# EasyEDA Pro project 组6-最终系统PCB.eprj

# Schematic Schematic1
Board Name: Board1; Create Date: 2024-12-04; Page Name: P1; Project Name: STC15娱乐掌机V3; Schematic Name: Schematic1; Update Date: 2024-12-04; Company: 嘉立创EDA; Page Size: A4; Version: V1.0
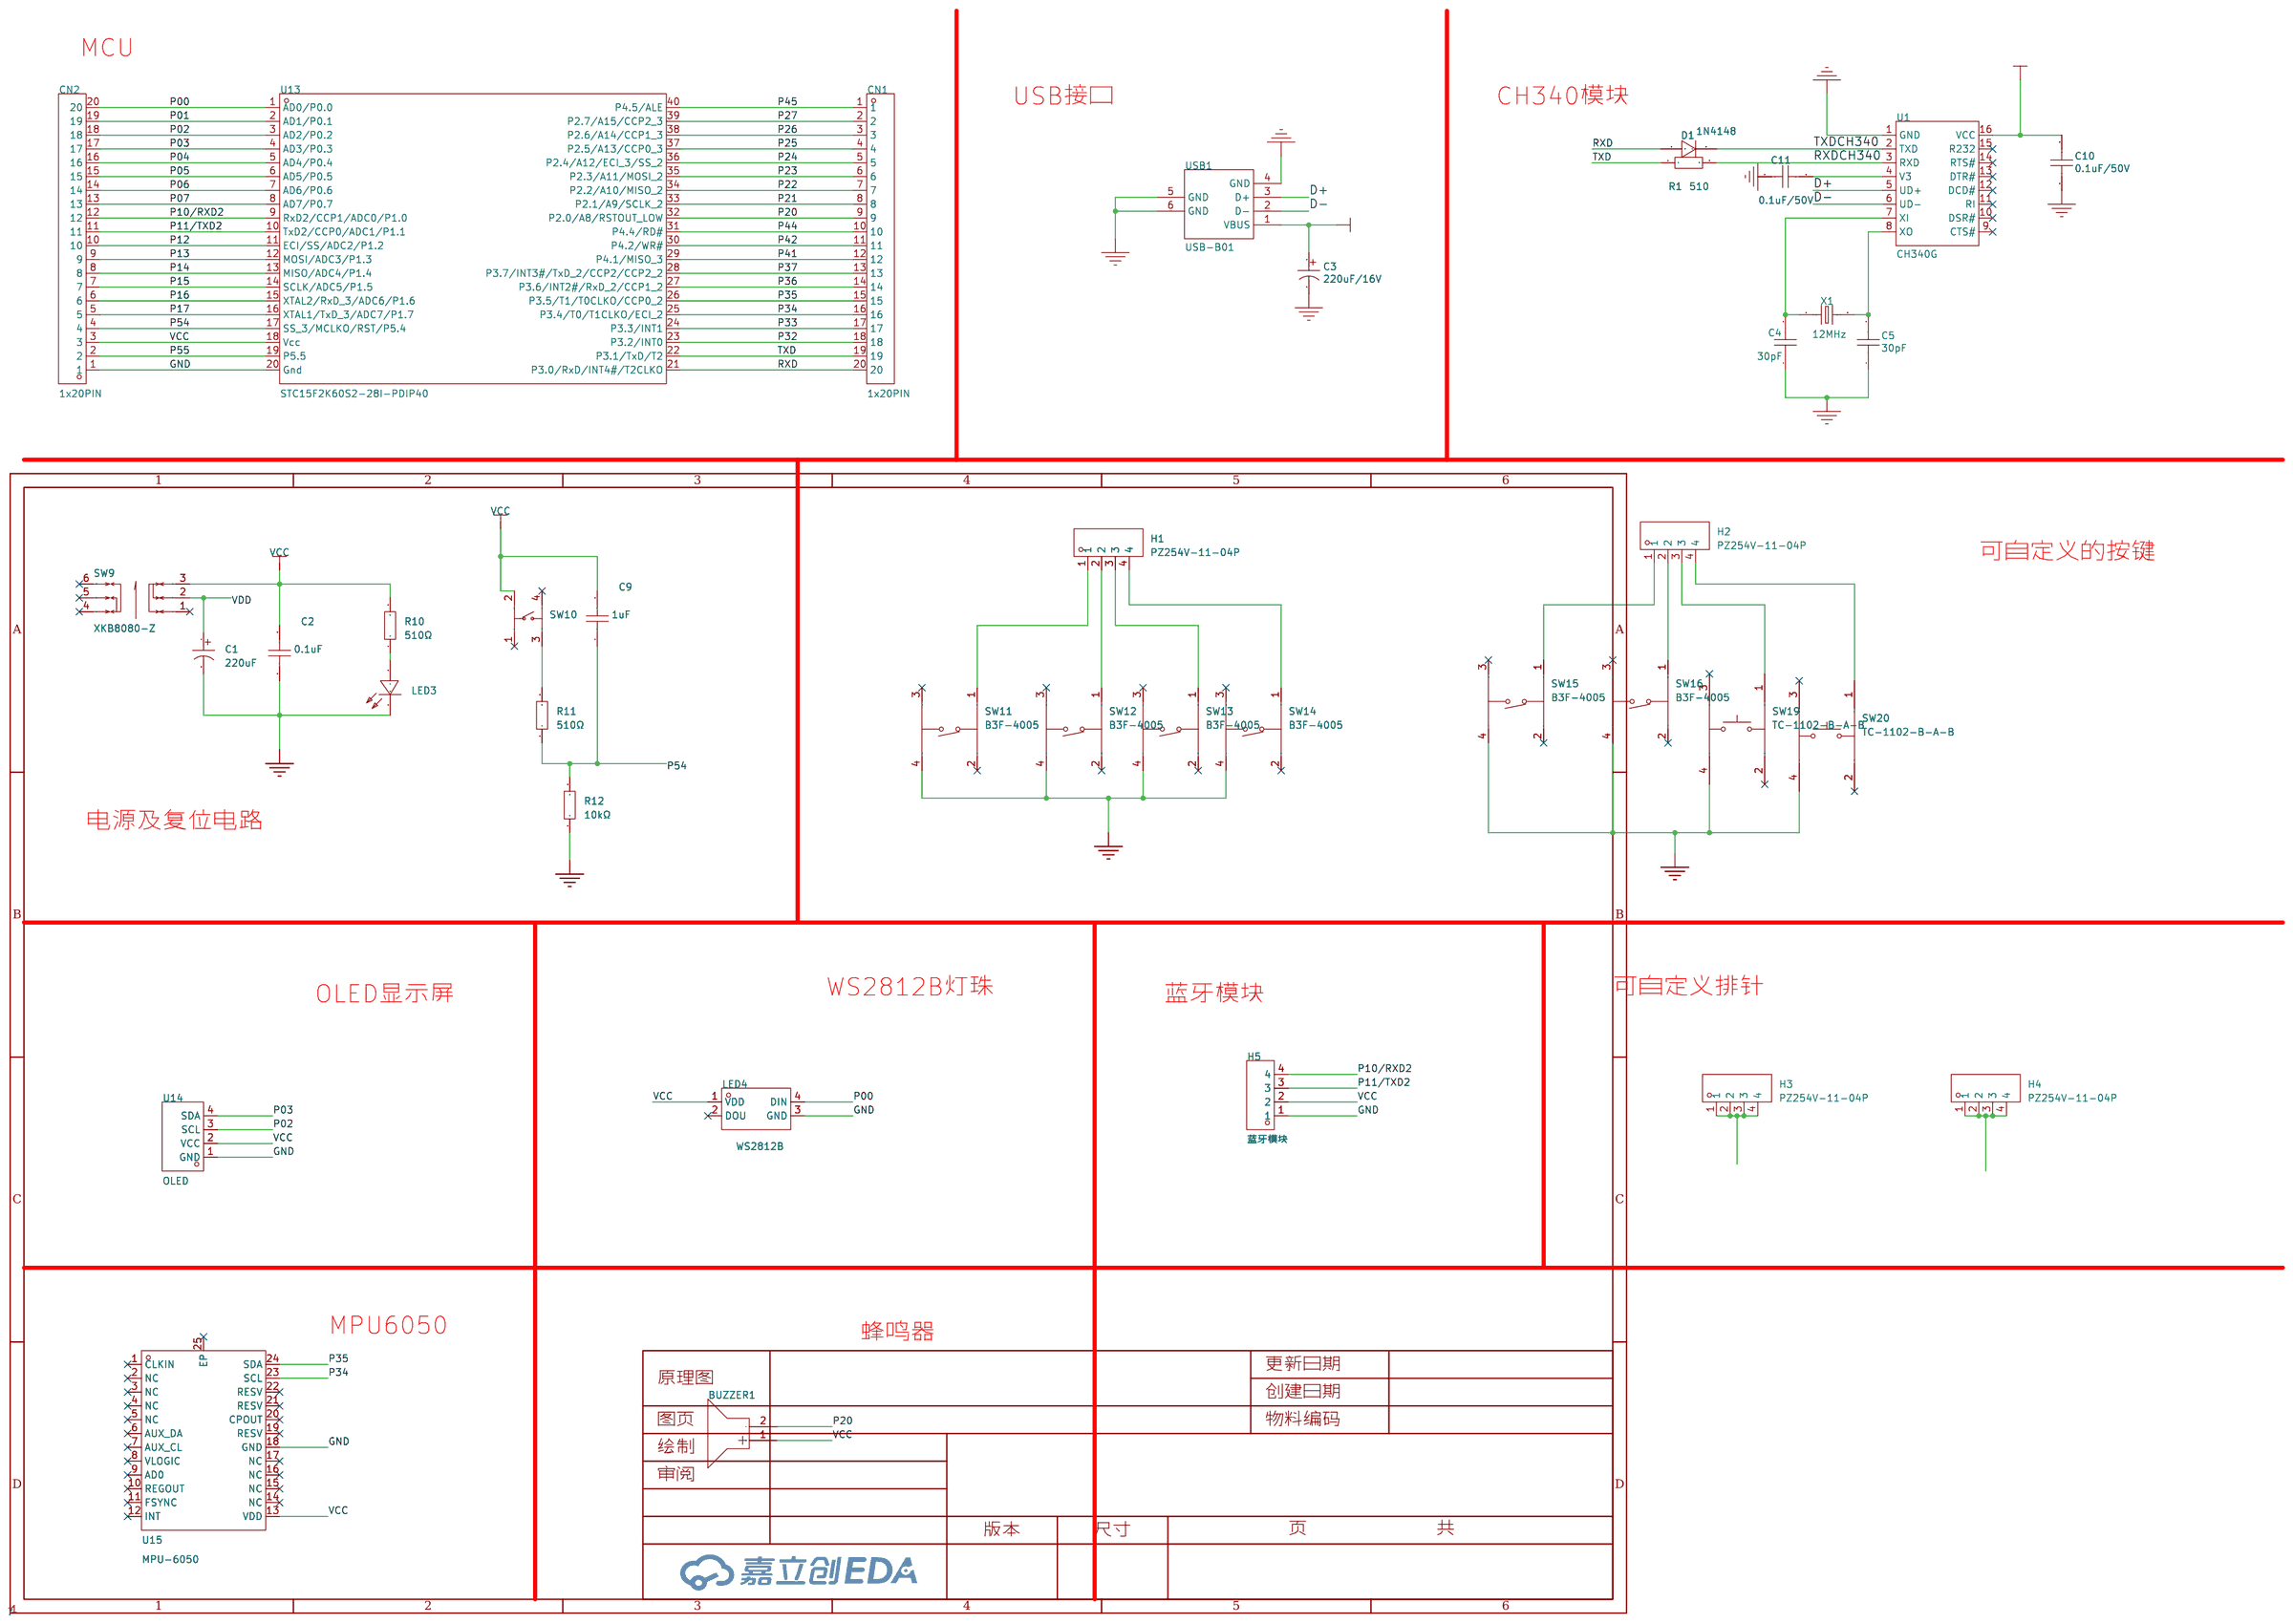
[diagram p0: schematic sheet]

## Parts
BUZZER1  3kHz  [BUZ-TH_BD9.0-P5.00-D0.6-FD]
C1  220uF  [CAP-TH_BD6.3-P2.50-D1.0-FD]
C2  0.1uF  [CAP-TH_L5.0-W2.5-P5.08-D0.7]
C3  220uF/16V  [CAP-TH_BD6.3-P2.50-D1.0-FD]
C4  30pF  [CAP-TH_L5.0-W2.5-P2.54-D0.7]
C5  30pF  [CAP-TH_L5.0-W2.5-P2.54-D0.7]
C9  1uF  [CAP-TH_L5.0-W2.5-P5.08-D0.7]
C10  0.1uF/50V  [CAP-TH_L5.0-W2.5-P2.54-D0.7]
C11  0.1uF/50V  [CAP-TH_L5.0-W2.5-P2.54-D0.7]
CN1  1x20PIN  [hdr-th_20p-p2.54-v-m-4]
CN2  1x20PIN  [hdr-th_20p-p2.54-v-m-4]
D1  1N4148  [DO-35_BD2.0-L4.0-P8.00-D0.5-FD]
H1  PZ254V-11-04P  [HDR-TH_4P-P2.54-V-M]
H2  PZ254V-11-04P  [HDR-TH_4P-P2.54-V-M]
H3  PZ254V-11-04P  [HDR-TH_4P-P2.54-V-M]
H4  PZ254V-11-04P  [HDR-TH_4P-P2.54-V-M]
H5  蓝牙模块  [HDR-TH_4P-P2.54-V-M]
LED3  LED1  [LED-TH_BD4.0-P2.50-RD]
LED4  WS2812B  [LED-SMD_4P-L5.0-W5.0-BL_XL-5050RGBC]
R1  510  [RES-TH_BD1.7-L3.5-P7.50-D0.5]
R10  510Ω  [RES-TH_BD2.3-L3.7-P7.70-D0.9]
R11  510Ω  [RES-TH_BD2.3-L3.7-P7.70-D0.9]
R12  10kΩ  [RES-TH_BD2.3-L3.7-P7.70-D0.9]
SW9  XKB8080-Z  [SW-TH_6P-L8.0-W8.0-P2.50]
SW10  KH-6X6X4.3H-TJ  [SW-TH_4P-L6.0-W6.0-P4.50-LS6.5]
SW11  B3F-4005  [SW-TH_4P-L12.0-W12.0-P5.00-LS12.5-EH]
SW12  B3F-4005  [SW-TH_4P-L12.0-W12.0-P5.00-LS12.5-EH]
SW13  B3F-4005  [SW-TH_4P-L12.0-W12.0-P5.00-LS12.5-EH]
SW14  B3F-4005  [SW-TH_4P-L12.0-W12.0-P5.00-LS12.5-EH]
SW15  B3F-4005  [SW-TH_4P-L12.0-W12.0-P5.00-LS12.5-EH]
SW16  B3F-4005  [SW-TH_4P-L12.0-W12.0-P5.00-LS12.5-EH]
SW19  TC-1102-B-A-B  [SW-TH_4P-L6.0-W6.0-P4.50-LS6.5]
SW20  TC-1102-B-A-B  [SW-TH_4P-L6.0-W6.0-P4.50-LS6.5]
U1  CH340G  [SOIC-16_L9.9-W3.9-P1.27-LS6.0-BL]
U13  STC15F2K60S2-28I-PDIP40  [DIP-40_L52.3-W13.9-P2.54-LS15.2-BL]
U14  OLED  [OLED-TH_L27.8-W27.2-P2.54_C9900033791]
U15  MPU-6050  [QFN-24_L4.0-W4.0-P0.50-BL-EP2.7]
USB1  USB-B01  [USB-B-TH_USB-B01]
X1  12MHz  [HC-49US_L11.5-W4.5-P4.88]

## Library data of the parts
BUZZER1 = HNB09A03: LCSC Part Name: 电磁式有源一体蜂鸣器HNB09A03; Supplier Part: C96102; Manufacturer: 华能; Supplier Footprint: 插件,D=9mm; JLCPCB Part Class: 扩展库; Datasheet: https://atta.szlcsc.com/upload/public/pdf/source/20170522/1495448326172.pdf; Supplier: LCSC; Oscillator Circuit: 有源(内含驱动线路); Technology Type: 电磁式; Operating Voltage: 1.5V~4.5V; Current Consumption: 30mA; Sound Pressure Level (SPL): 85dB@10cm; Diameter (φD): 9mm; Height: 5.5mm; Operating Temperature: -20℃~+70℃
C1 = ZF227M010E07RR0VH4FP0: 容值:220uF;精度:±20%;额定电压:10V;纹波电流:-;等效串联电阻:-;; LCSC Part Name: 220uF ±20% 10V 黑; Supplier Part: C43331; Manufacturer: CX(承兴); Supplier Footprint: 插件,D6.3xL7mm; JLCPCB Part Class: 扩展库; Datasheet: https://atta.szlcsc.com/upload/public/pdf/source/20211027/BC8F7E368CF510796C09133063E82C9C.pdf; Supplier: LCSC; Tolerance: ±20%; Rated Voltage: 10V; Lead Spacing: 2.5mm; φD: 6.3mm; L: 7mm; Lifetime @ Temp: 1000hrs@105℃; Operating Temperature: -40℃~+105℃
C2 C9 = CC1H330JC74DCH4B10MN: 容值:33pF;精度:±5%;额定电压:50V;温度系数:NP0;; LCSC Part Name: 33pF ±5% 50V; Supplier Part: C254101; Manufacturer: Dersonic(德尔创); Supplier Footprint: 插件,P=5.08mm; JLCPCB Part Class: 扩展库; Datasheet: https://atta.szlcsc.com/upload/public/pdf/source/20200826/C254101_16B526CCB578B7B7F57569795E2616C1.pdf; Supplier: LCSC; Tolerance: ±5%; Voltage Rated: 50V; Lead Spacing: 5.08mm; Temperature Coefficient: NP0; φD: 4.7mm; Body Thickness: 2.2mm
C3 = 220uF/16V: Supplier: LCSC; Supplier Part: C311676; Manufacturer: Lelon; Manufacturer Part: SS-101M1ASA-0605; JLCPCB Part Class: Extended Part; Design Item ID: 100uF; Library Name: 51单片机SCH库 -v1
C4 C5 = 30pF: ±5% 50V  瓷片电容 直插; Supplier: LCSC; Manufacturer: FH; Manufacturer Part: CC4-0805N300J500F3; Supplier Part: C94716; JLCPCB Part Class: Extended Part; Library Name: 51单片机SCH库 -v1
C10 C11 = 0.1uF/50V: ±5% 50V  瓷片电容 直插; Supplier: LCSC; Manufacturer: FH; Manufacturer Part: CC4-0805N300J500F3; Supplier Part: C94716; JLCPCB Part Class: Extended Part; Design Item ID: 30pF; Library Name: 51单片机SCH库 -v1
CN1 CN2 = HC-PZ254-11.5L-1x20PZ: 插针结构:1x20P;间距:2.54mm;行距:-;圆针/方针:方针;安装类型:直插;排数:单排;总PIN位数:20P;额定电流:3A;配合针长度:6mm;塑高:2.5mm;端接针长度:3mm;触头材质:黄铜;触头镀层:金;工作温度范围:-40℃~+105℃;焊接温度(最大值):260℃;颜色:黑色;; LCSC Part Name: 间距2.54mm 1x20Pin 直插 H2.5 L11.5; Supplier Part: C27985199; Manufacturer: HC(虹成电子); Supplier Footprint: 插件,P=2.54mm; JLCPCB Part Class: 扩展库; Datasheet: https://atta.szlcsc.com/upload/public/pdf/source/20240710/EBB73ACECFFBB056933A78571A4AC703.pdf; Supplier: LCSC; Pin Structure: 1x20P; Pitch: 2.54mm; Circluar Pins/Square Pins: 方针; Mounting Type: 直插; Number of Rows: 单排; Number of Pins: 20P; Current Rating (Max): 3A; Length of Mating Pin: 6mm; Insulation Height: 2.5mm; Length of End Connection Pin: 3mm; Contact Material: 黄铜; Contact Plating: 金; Operating Temperature Range: -40℃~+105℃; Soldering Temperature(Max): 260℃; Color: 黑色
D1 = 1N4148: Supplier: LCSC; Supplier Part: C258182; Manufacturer: ON Semicon; JLCPCB Part Class: Extended Part; Library Name: 51单片机SCH库 -v1
H1-H5 = PZ254V-11-04P: 插针结构:1x4P;间距:2.54mm;行距:-;圆针/方针:方针;安装类型:直插;排数:单排;总PIN位数:4P;额定电流:3A;额定电压:250V;配合针长度:6mm;塑高:2.5mm;端接针长度:3mm;触头材质:-;工作温度范围:-40℃~+105℃;颜色:黑色;; LCSC Part Name: 间距:2.54mm 1x4P 直插 方针; Supplier Part: C2691448; Manufacturer: XFCN(兴飞); Supplier Footprint: 插件,P=2.54mm; JLCPCB Part Class: 扩展库; Datasheet: https://atta.szlcsc.com/upload/public/pdf/source/20200309/C492403_F9F19131791D08044AD4F84F8E751A34.pdf; Supplier: LCSC; Pin Structure: 1x4P; Pitch: 2.54mm; Circluar Pins/Square Pins: 方针; Mounting Type: 直插; Number of Rows: 单排; Number of Pins: 4P; Current Rating (Max): 3A; Voltage Rating (Max): 250V; Length of Mating Pin: 6mm; Insulation Height: 2.5mm; Length of End Connection Pin: 3mm; Operating Temperature Range: -40℃~+105℃; Color: 黑色
LED3 = 204-10SDRD/S530-A3/F182-68: Supplier Part: C473831; Manufacturer: EVERLIGHT(亿光); Supplier Footprint: 插件; JLCPCB Part Class: 扩展库; Supplier: LCSC
LED4 = XL-5050RGBC-WS2812B: Supplier Part: C2843785; Manufacturer: XINGLIGHT(成兴光); Supplier Footprint: SMD5050; JLCPCB Part Class: 扩展库; Datasheet: https://atta.szlcsc.com/upload/public/pdf/source/20240412/E1004CAA80592E31D08BFE019083806F.pdf; Supplier: LCSC
R1 = 510/0.125W: 金属膜电阻/1/8W; Supplier: LCSC; Supplier Part: C349057; Manufacturer: ResistorToday; Manufacturer Part: EWWR0008J4K70T9; JLCPCB Part Class: Extended Part; Design Item ID: 4.7K; Library Name: 51单片机SCH库 -v1
R10-R12 = MF1/8W-330Ω±1%-OT52: 电阻类型:金属膜电阻;阻值:330Ω;精度:±1%;功率:125mW;温度系数:±350ppm/℃;; LCSC Part Name: 金属膜电阻 330Ω ±1% 125mW; Supplier Part: C2848567; Manufacturer: VO(翔胜); Supplier Footprint: 插件,D2.3xL3.7mm; JLCPCB Part Class: 扩展库; Supplier: LCSC; Type: 金属膜电阻; Tolerance: ±1%; Overload Voltage (Max): 200V; Power(Watts): 125mW; Temperature Coefficient: ±350ppm/℃; Operating Temperature Range: -55℃~+155℃
SW9 = XKB8080-Z: 自锁/无锁:自锁;安装方式:直插;触点电流:100mA;额定电压 (AC):250V;额定电压 (DC):30V;带灯:不带;作用力:160gf;机械寿命:10万次;; LCSC Part Name: 8*8 蓝白黑 自锁开关; Supplier Part: C318860; Manufacturer: XKB Connectivity(中国星坤); Supplier Footprint: 插件; JLCPCB Part Class: 扩展库; Datasheet: https://atta.szlcsc.com/upload/public/pdf/source/20200227/C318861_0CCDF4510CAD1098054D1FAD25282ED5.pdf; Supplier: LCSC; Self Lock / No Lock: 自锁; Actuator Style: 矩形按钮; Mounting Style: 直插; Contact Current: 100mA; Voltage Rating (AC): 250V; Voltage Rating (DC): 30V; Insulation Resistance: 100MΩ; Actuator/Cap Color: 蓝色; With Lamp: 不带; Pin Style: PC引脚; Operating Force: 160gf; Operating Temperature: -15℃~+55℃; Mechanical Life: 10万次
SW10 = KH-6X6X4.3H-TJ: 电路结构:单刀单掷;按钮形状:圆形按钮;作用力:260gf;安装方式:直插;开关长度:6mm;开关宽度:6mm;开关高度:4.3mm;带支架:不带;触点电流:50mA;额定电压(DC):12V;绝缘电阻:100MΩ;机械寿命:-;; LCSC Part Name: 6*6*4.3mm 直插 轻触开关; Supplier Part: C2837514; Manufacturer: kinghelm(金航标); Supplier Footprint: 插件; JLCPCB Part Class: 扩展库; Datasheet: https://atta.szlcsc.com/upload/public/pdf/source/20210608/C2837514_0D06B95E18851D47826D3A0BDAD15CC2.pdf; Supplier: LCSC; Circuit: 单刀单掷; Actuator Style: 圆形按钮; Operating Force: 260gf; Mounting Style: 直插; Switch Length: 6mm; Switch Width: 6mm; Switch Height: 4.3mm; Strike Gundam: 不带; Contact Current: 50mA; Voltage Rating (DC): 12V; Insulation Resistance: 100MΩ; Actuator/Cap Color: 黑色; Pin Style: PC引脚; Operating Temperature: -25℃~+70℃
SW11-SW16 = B3F-4005: 电路结构:单刀单掷;按钮形状:圆形按钮;安装方式:直插;开关长度:12mm;开关宽度:12mm;开关高度:4.3mm;带灯:-;机械寿命:-;; LCSC Part Name: 12*12*4.3mm 直插 轻触开关; Supplier Part: C397283; Manufacturer: OMRON(欧姆龙); Supplier Footprint: 插件,12x12mm; JLCPCB Part Class: 扩展库; Datasheet: https://atta.szlcsc.com/upload/public/pdf/source/20191212/C469135_90BE0DB612FA51D178D2ECFD00DF8DE6.pdf; Supplier: LCSC; Circuit: 单刀单掷; Actuator Style: 圆形按钮; Mounting Style: 直插; Switch Length: 12mm; Switch Width: 12mm; Switch Height: 4.3mm
SW19 SW20 = TC-1102-B-A-B: 电路结构:单刀单掷;按钮形状:圆形按钮;作用力:160gf;安装方式:直插;开关长度:6mm;开关宽度:6mm;开关高度:4.3mm;带支架:不带;触点电流:50mA;额定电压(DC):12V;绝缘电阻:-;带灯:无;机械寿命:30万次;; LCSC Part Name: 6*6*4.3mm 直插 轻触开关; Supplier Part: C480281; Manufacturer: XKB Connectivity(中国星坤); Supplier Footprint: 插件; JLCPCB Part Class: 扩展库; Datasheet: https://atta.szlcsc.com/upload/public/pdf/source/20211011/5338952D91EAA82439B0E0118625537B.pdf; Supplier: LCSC; Circuit: 单刀单掷; Actuator Style: 圆形按钮; Operating Force: 160gf; Mounting Style: 直插; Switch Length: 6mm; Switch Width: 6mm; Switch Height: 4.3mm; Strike Gundam: 不带; Contact Current: 50mA; Voltage Rating (DC): 12V; Actuator/Cap Color: 黑色; With Lamp: 无; Pin Style: PC引脚; Mechanical Life: 30万次; Operating Temperature: -30℃~+85℃
U1 = CH340G: Supplier: LCSC; Manufacturer: WCH; Supplier Part: C14267; JLCPCB Part Class: Basic Part; Library Name: 51单片机SCH库 -v1
U13 = STC15F2K60S2-28I-PDIP40: CPU内核:51系列;程序存储容量:60KB;RAM总容量:2KB;GPIO端口数量:38;工作电压范围:3.8V~5.5V;CPU最大主频:-;程序存储器类型:FLASH;; Supplier Part: C57308; Manufacturer: STC(宏晶); Supplier Footprint: DIP-40; JLCPCB Part Class: 扩展库; Datasheet: https://atta.szlcsc.com/upload/public/pdf/source/20170425/1493115792212.pdf; Supplier: LCSC; CPU Core: 51系列; Program Storage Size: 60KB; RAM Size: 2KB; GPIO Ports Number: 38; Operating Voltage Range: 3.8V~5.5V; Program Memory Type: FLASH; Operating Temperature Range: -40℃~+85℃; ADC (Bit): 10bit; 16Bit Timer: 3; UART/USART: 2; SPI: 1; Peripheral/Function: 低电压检测；看门狗；CCP捕获/比较; Watchdog: 有; Low-Voltage Detect: 有; CCP Capture/Compare: 有; Internal Oscillator: 有
U14 = HS96L03W2C03: LCSC Part Name: 0.96寸OLED显示屏窄白光IIC; Supplier Part: C5248080; Manufacturer: HS(汉昇); JLCPCB Part Class: 扩展库; Datasheet: https://atta.szlcsc.com/upload/public/pdf/source/20230627/763D01F79A90007632F098068C7C8AD9.pdf; Supplier: LCSC; Main Control Chip: SSD1315; Interface Type: I2C; Size: 0.96; Pixel Resolution: 128x64; Operating Temperature: -40℃~+70℃
U15 = MPU-6050: 传感器类型:加速度计陀螺仪;; Supplier Part: C24112; Manufacturer: TDK InvenSense(应美盛); Supplier Footprint: QFN-24-EP(4x4); JLCPCB Part Class: 扩展库; Datasheet: https://atta.szlcsc.com/upload/public/pdf/source/20140425/1457707046159.pdf; Supplier: LCSC; Sensor Type: 加速度计陀螺仪; Operating Temperature: -40℃~+85℃
USB1 = USB-B01: 卧式B型USB连接器/母座 90度 USB-B01; Supplier: LCSC; Supplier Part: C498173; Manufacturer: SOFNG; JLCPCB Part Class: Extended Part; Library Name: 51单片机SCH库 -v1
X1 = 12MHz: Supplier: LCSC; Manufacturer: TAE; Manufacturer Part: HC-49S12MHz20pF30PPM; Supplier Part: C127674; JLCPCB Part Class: Extended Part; Library Name: 51单片机SCH库 -v1

## Nets
GND: C1.2 C2.1 C3.2 C4.1 C5.1 C10.1 C11.1 CN2.1 H5.1 LED3.1(C) LED4.3(GND) R12.1 SW11.4 SW12.4 SW13.4 SW14.4 SW15.4 SW16.4 SW19.4 SW20.4 U1.1(GND) U13.20(Gnd) U14.1(GND) U15.18(GND) USB1.4(GND) USB1.5(GND) USB1.6(GND)
VCC: BUZZER1.1(+) C2.2 C9.2 CN2.3 H5.2 LED4.1(VDD) R10.2 SW9.3 SW10.2 U13.18(Vcc) U14.2(VCC) U15.13(VDD)
VDD: C1.1 C3.1 C10.2 SW9.2 U1.16(VCC) USB1.1(VBUS)
D+: U1.5(UD+) USB1.3(D+)
D-: U1.6(UD-) USB1.2(D-)
P00: CN2.20 LED4.4(DIN) U13.1(AD0/P0.0)
P01: CN2.19 U13.2(AD1/P0.1)
P02: CN2.18 U13.3(AD2/P0.2) U14.3(SCL)
P03: CN2.17 U13.4(AD3/P0.3) U14.4(SDA)
P04: CN2.16 U13.5(AD4/P0.4)
P05: CN2.15 U13.6(AD5/P0.5)
P06: CN2.14 U13.7(AD6/P0.6)
P07: CN2.13 U13.8(AD7/P0.7)
P10/RXD2: CN2.12 H5.4 U13.9(RxD2/CCP1/ADC0/P1.0)
P11/TXD2: CN2.11 H5.3 U13.10(TxD2/CCP0/ADC1/P1.1)
P12: CN2.10 U13.11(ECI/SS/ADC2/P1.2)
P13: CN2.9 U13.12(MOSI/ADC3/P1.3)
P14: CN2.8 U13.13(MISO/ADC4/P1.4)
P15: CN2.7 U13.14(SCLK/ADC5/P1.5)
P16: CN2.6 U13.15(XTAL2/RxD_3/ADC6/P1.6)
P17: CN2.5 U13.16(XTAL1/TxD_3/ADC7/P1.7)
P20: BUZZER1.2(-) CN1.9 U13.32(P2.0/A8/RSTOUT_LOW)
P21: CN1.8 U13.33(P2.1/A9/SCLK_2)
P22: CN1.7 U13.34(P2.2/A10/MISO_2)
P23: CN1.6 U13.35(P2.3/A11/MOSI_2)
P24: CN1.5 U13.36(P2.4/A12/ECI_3/SS_2)
P25: CN1.4 U13.37(P2.5/A13/CCP0_3)
P26: CN1.3 U13.38(P2.6/A14/CCP1_3)
P27: CN1.2 U13.39(P2.7/A15/CCP2_3)
P32: CN1.18 U13.23(P3.2/INT0)
P33: CN1.17 U13.24(P3.3/INT1)
P34: CN1.16 U13.25(P3.4/T0/T1CLKO/ECI_2) U15.23(SCL)
P35: CN1.15 U13.26(P3.5/T1/T0CLKO/CCP0_2) U15.24(SDA)
P36: CN1.14 U13.27(P3.6/INT2#/RxD_2/CCP1_2)
P37: CN1.13 U13.28(P3.7/INT3#/TxD_2/CCP2/CCP2_2)
P41: CN1.12 U13.29(P4.1/MISO_3)
P42: CN1.11 U13.30(P4.2/WR#)
P44: CN1.10 U13.31(P4.4/RD#)
P45: CN1.1 U13.40(P4.5/ALE)
P54: C9.1 CN2.4 R11.1 R12.2 U13.17(SS_3/MCLKO/RST/P5.4)
P55: CN2.2 U13.19(P5.5)
RXD: CN1.20 D1.1(A) U13.21(P3.0/RxD/INT4#/T2CLKO)
RXDCH340: R1.2 U1.3(RXD)
TXD: CN1.19 R1.1 U13.22(P3.1/TxD/T2)
TXDCH340: D1.2(K) U1.2(TXD)
$1N13235: LED3.2(A) R10.1
$1N13359: R11.2 SW10.3
$1N17550: C4.2 U1.7(XI) X1.1
$1N17568: C11.2 U1.4(V3)
$1N17576: C5.2 U1.8(XO) X1.2
$1N18234: H1.1 SW11.1
$1N18255: H1.2 SW12.1
$1N18272: H1.3 SW13.1
$1N18278: H1.4 SW14.1
$1N18641: H2.1 SW15.1
$1N18645: H2.2 SW16.1
$1N18647: H2.3 SW19.1
$1N18651: H2.4 SW20.1
$1N21741: H3.1 H3.2 H3.3 H3.4
$1N21762: H4.1 H4.2 H4.3 H4.4

Not connected (* = marked no-connect by the designer): LED4 2(DOU)*; SW9 1* 4* 5* 6*; SW10 1* 4*; SW11 2* 3*; SW12 2* 3*; SW13 2* 3*; SW14 2* 3*; SW15 2* 3*; SW16 2* 3*; SW19 2* 3*; SW20 2* 3*; U1 9(CTS#)* 10(DSR#)* 11(RI)* 12(DCD#)* 13(DTR#)* 14(RTS#)* 15(R232)*; U15 1(CLKIN)* 2(NC)* 3(NC)* 4(NC)* 5(NC)* 6(AUX_DA)* 7(AUX_CL)* 8(VLOGIC)* 9(AD0)* 10(REGOUT)* 11(FSYNC)* 12(INT)* 14(NC)* 15(NC)* 16(NC)* 17(NC)* 19(RESV)* 20(CPOUT)* 21(RESV)* 22(RESV)* 25(EP)*

## Notes on the sheet
- MCU
- USB接口
- CH340模块
- 可自定义的按键
- 电源及复位电路
- OLED显示屏
- WS2812B灯珠
- 蓝牙模块
- 可自定义排针
- MPU6050
- 蜂鸣器

# Board PCB1
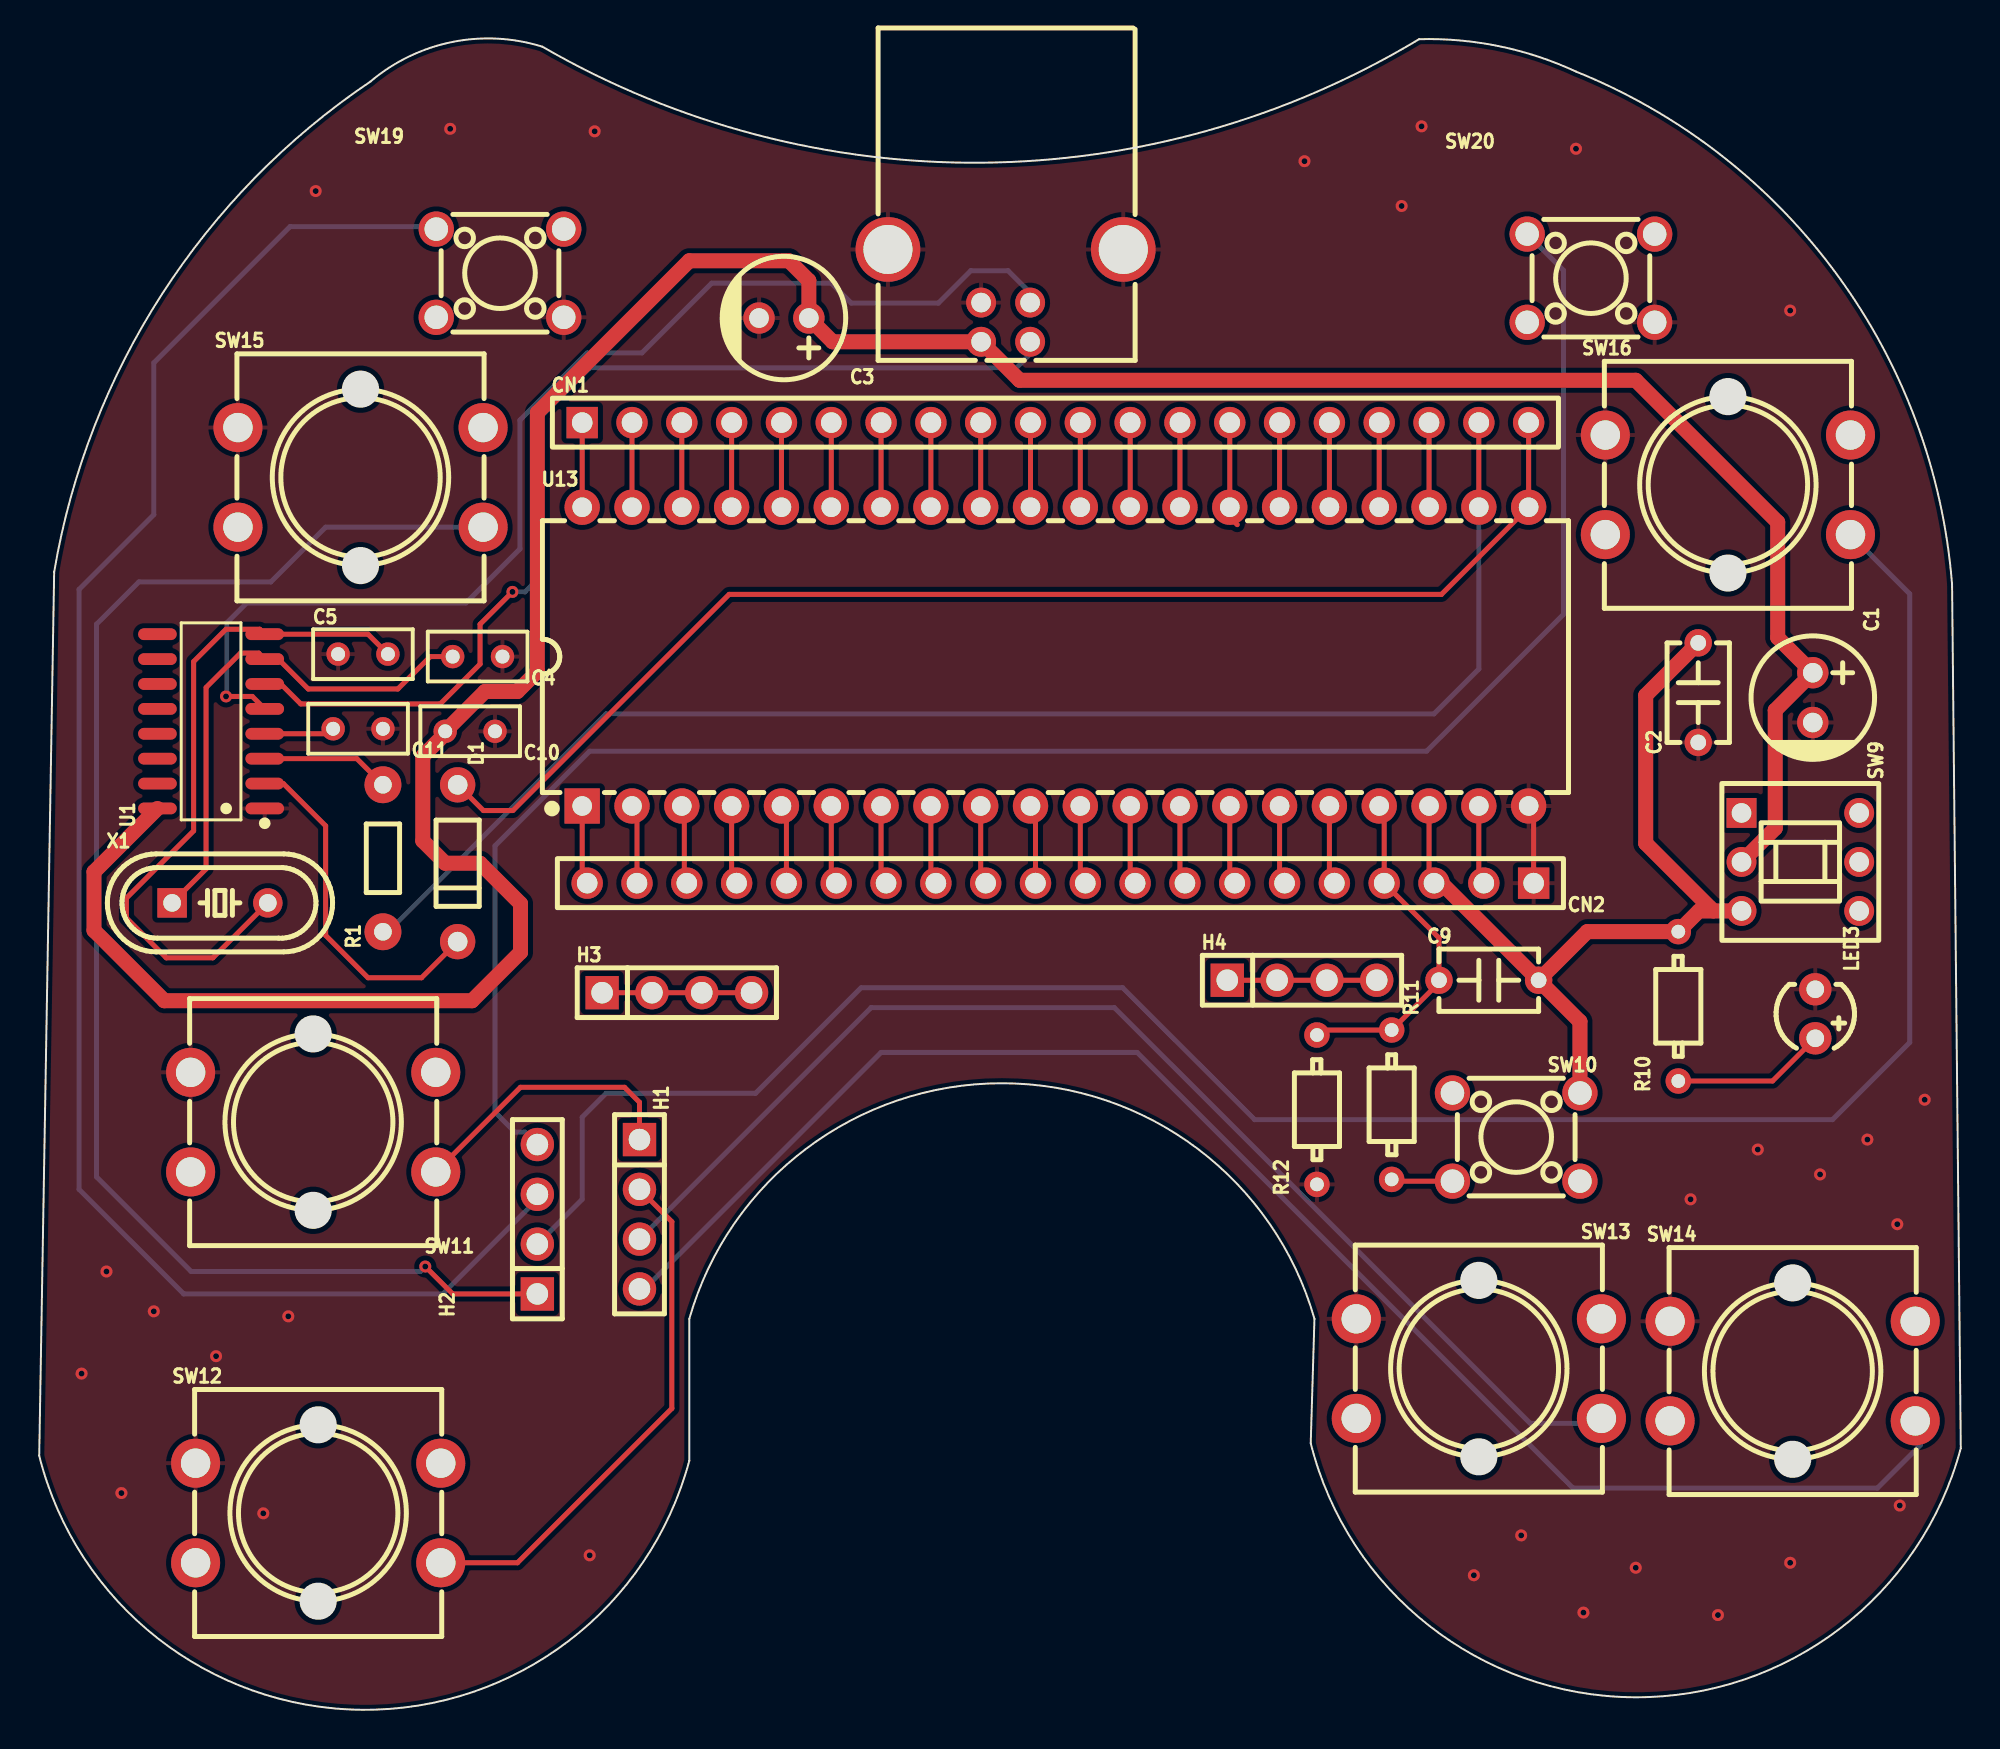
[diagram p1: board, top side]
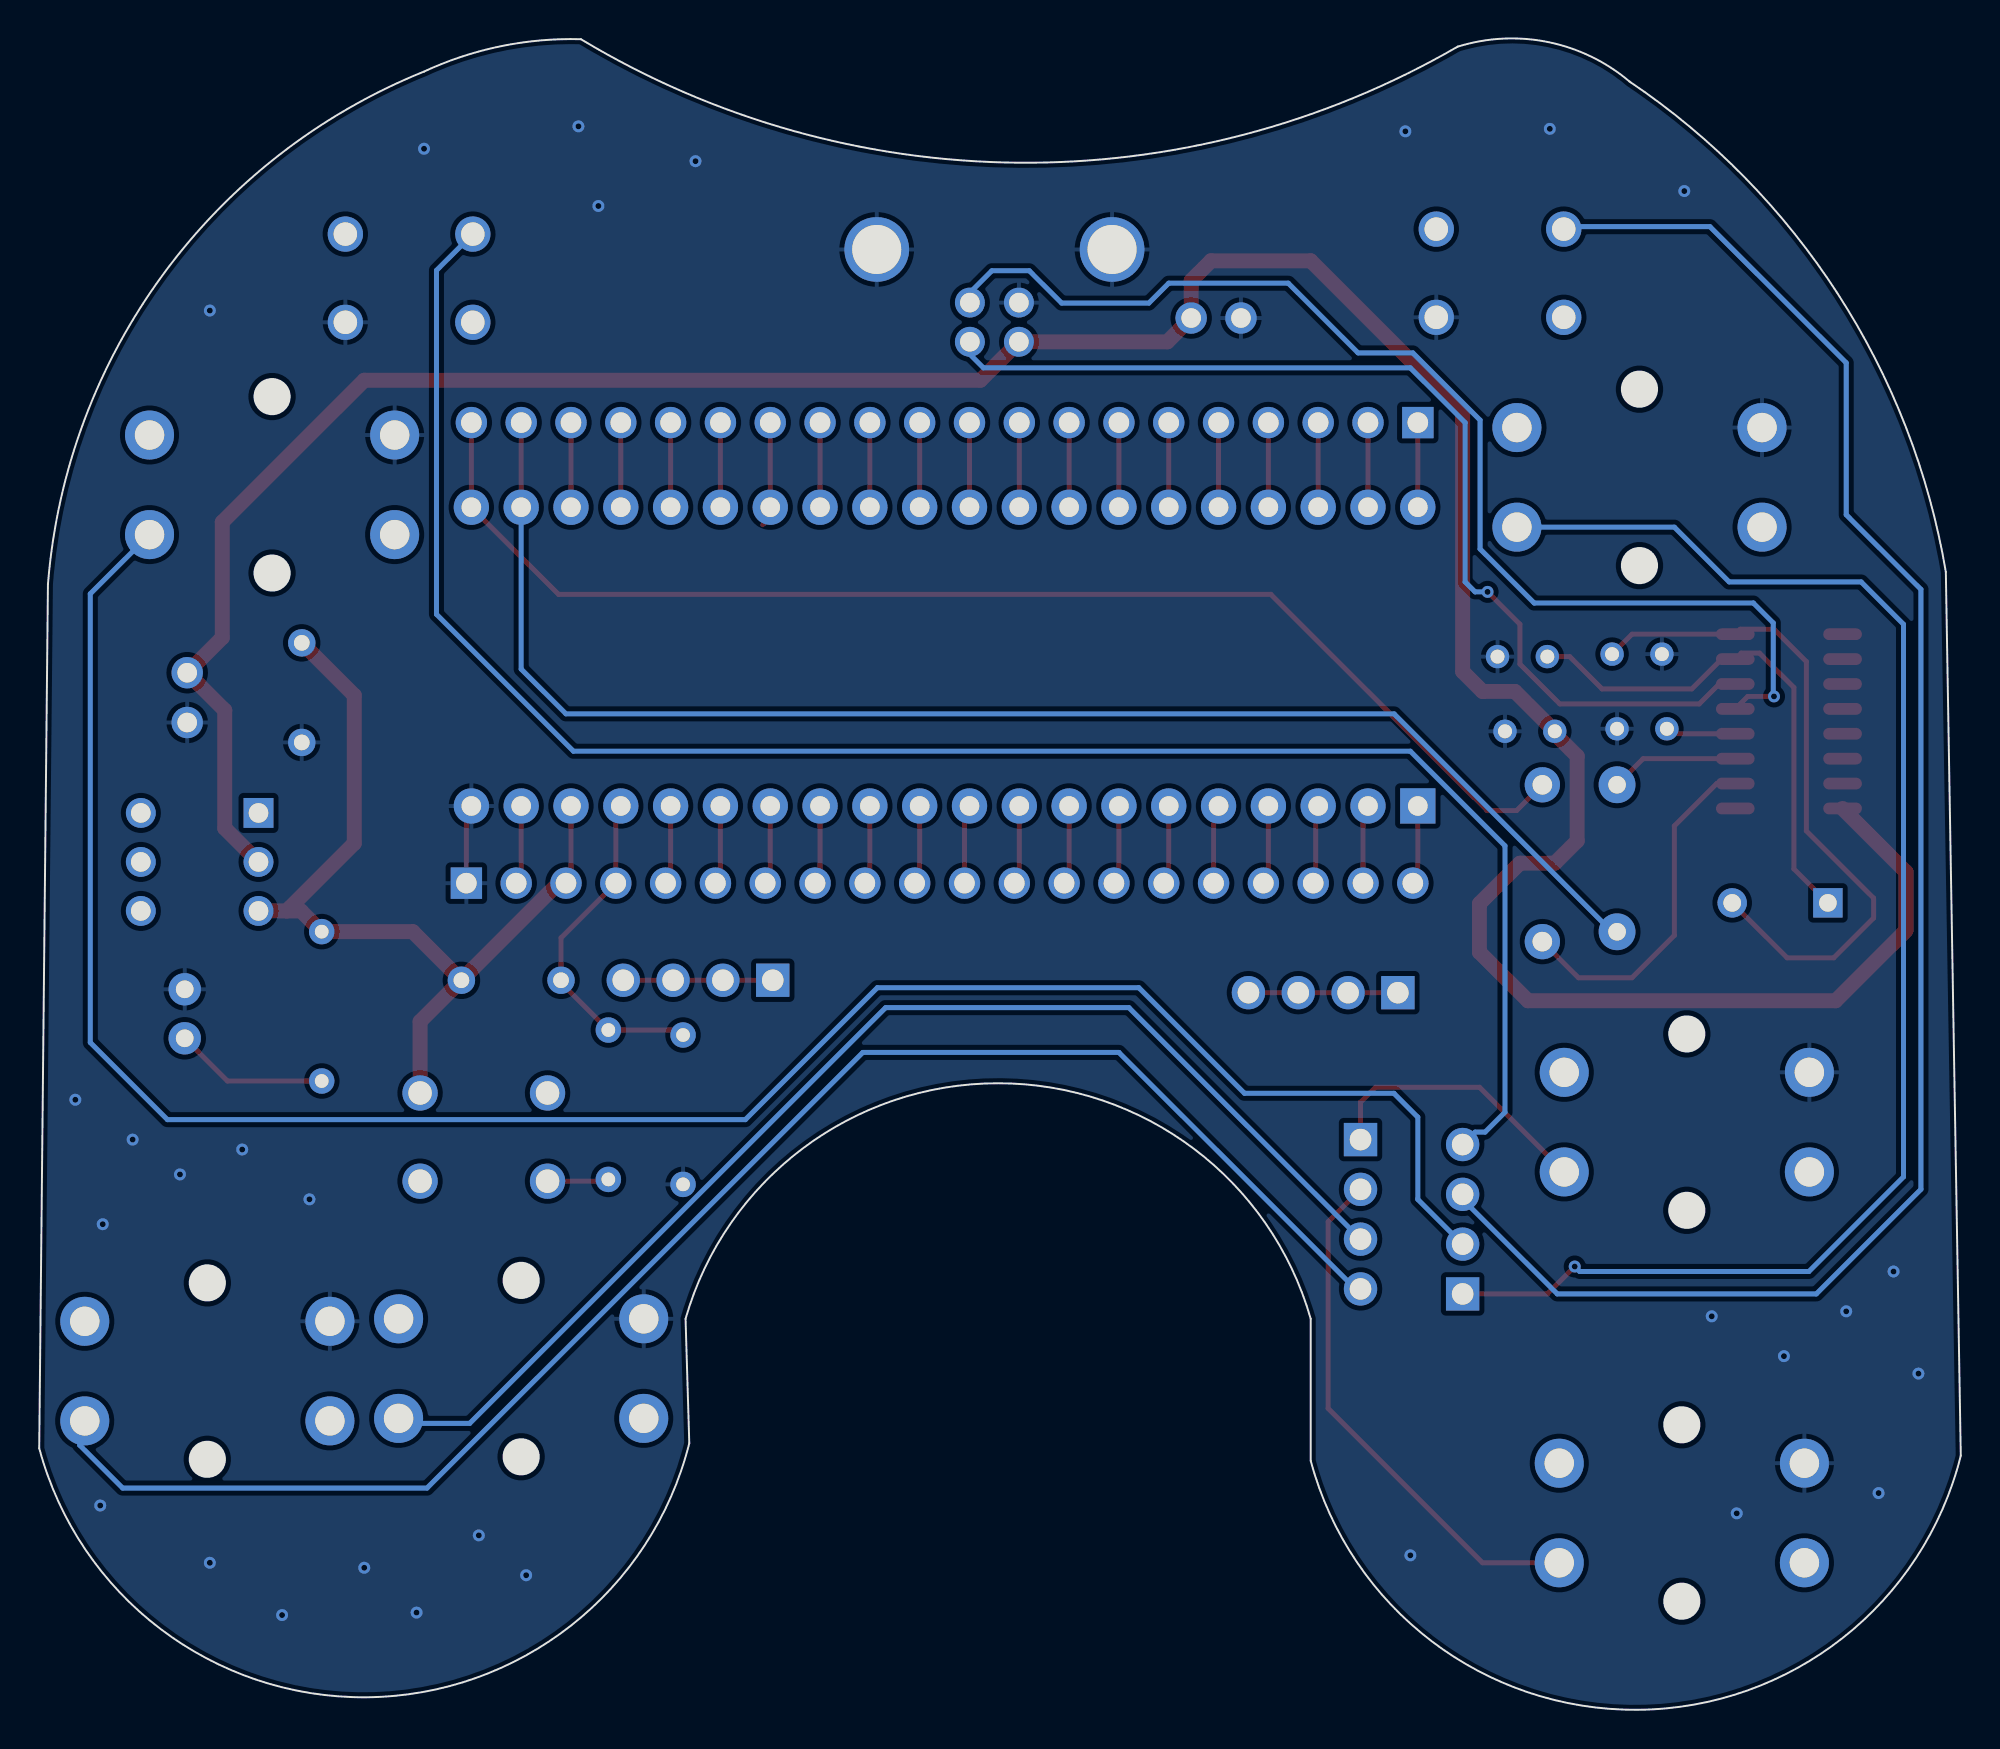
[diagram p2: board, bottom side, seen from below]

Outline 97.98 x 85.22 mm; copper layers: Top Layer, Bottom Layer. Coordinates in mm from the lower left corner of the outline.
Outline path: 0.76,58.05 0,12.96 arc(16.48,0) 33.15,12.71 33.15,19.95 arc(49.09,31.96) 65.02,19.95 64.83,13.6 arc(81.31,0.64) 97.98,13.35 97.54,57.41 arc(91.67,73.22) 78.36,83.57 arc(74.45,84.86) 70.36,85.22 arc(48.06,78.92) 25.65,84.84 arc(21.04,85.08) 16.89,83.06 arc(6.26,72.21) 0.76,58.05
Stack: Top Layer 0.035mm / Dielectric1 1.51mm FR4 er 4.5 / Bottom Layer 0.035mm

## Design rules (mm)
template: JLCPCB Capability(Two Layers Board)
spacing copperThickness1oz (default): track to track 0.102, other pairs 0.152 to 0.3
spacing copperThickness2oz: track to track 0.203, other pairs 0.152 to 0.3
track width copperThickness1oz (default): min 0.127, default 0.254, max 2.54
track width copperThickness2oz: min 0.203, default 0.254, max 2.54
differential pair differentialPair (default): width min 0.127, default 0.254, max 2.54; gap min 0.152, default 0.152
via viaSize (default): diameter min 0.5, default 0.61, max 10; hole min 0.3, default 0.305, max 6.3

## Placement (name value [footprint] x y rotation side)
C1  220uF  [CAP-TH_BD6.3-P2.50-D1.0-FD]  90.43 51.64 270 top
C2  0.1uF  [CAP-TH_L5.0-W2.5-P5.08-D0.7]  84.59 51.89 90 top
C3  220uF/16V  [CAP-TH_BD6.3-P2.50-D1.0-FD]  37.97 71 180 top
C4  30pF  [CAP-TH_L5.0-W2.5-P2.54-D0.7]  22.35 53.73 180 top
C5  30pF  [CAP-TH_L5.0-W2.5-P2.54-D0.7]  16.51 53.85 0 top
C9  1uF  [CAP-TH_L5.0-W2.5-P5.08-D0.7]  73.91 37.22 0 top
C10  0.1uF/50V  [CAP-TH_L5.0-W2.5-P2.54-D0.7]  21.97 49.92 180 top
C11  0.1uF/50V  [CAP-TH_L5.0-W2.5-P2.54-D0.7]  16.26 50.04 180 top
CN1  1x20PIN  [hdr-th_20p-p2.54-v-m-4]  51.82 65.67 0 top
CN2  1x20PIN  [hdr-th_20p-p2.54-v-m-4]  52.07 42.17 180 top
D1  1N4148  [DO-35_BD2.0-L4.0-P8.00-D0.5-FD]  21.34 43.19 270 top
H1  PZ254V-11-04P  [HDR-TH_4P-P2.54-V-M]  30.61 25.28 270 top
H2  PZ254V-11-04P  [HDR-TH_4P-P2.54-V-M]  25.4 25.03 90 top
H3  PZ254V-11-04P  [HDR-TH_4P-P2.54-V-M]  32.51 36.58 0 top
H4  PZ254V-11-04P  [HDR-TH_4P-P2.54-V-M]  64.39 37.22 0 top
LED3  LED1  [LED-TH_BD4.0-P2.50-RD]  90.56 35.51 270 top
R1  510  [RES-TH_BD1.7-L3.5-P7.50-D0.5]  17.53 43.44 90 top
R10  510Ω  [RES-TH_BD2.3-L3.7-P7.70-D0.9]  83.58 35.89 90 top
R11  510Ω  [RES-TH_BD2.3-L3.7-P7.70-D0.9]  68.96 30.87 270 top
R12  10kΩ  [RES-TH_BD2.3-L3.7-P7.70-D0.9]  65.15 30.61 90 top
SW9  XKB8080-Z  [SW-TH_6P-L8.0-W8.0-P2.50]  89.8 43.25 270 top
SW10  KH-6X6X4.3H-TJ  [SW-TH_4P-L6.0-W6.0-P4.50-LS6.5]  75.31 29.22 0 top
SW11  B3F-4005  [SW-TH_4P-L12.0-W12.0-P5.00-LS12.5-EH]  13.97 29.98 0 top
SW12  B3F-4005  [SW-TH_4P-L12.0-W12.0-P5.00-LS12.5-EH]  14.22 10.04 0 top
SW13  B3F-4005  [SW-TH_4P-L12.0-W12.0-P5.00-LS12.5-EH]  73.41 17.41 0 top
SW14  B3F-4005  [SW-TH_4P-L12.0-W12.0-P5.00-LS12.5-EH]  89.41 17.28 0 top
SW15  B3F-4005  [SW-TH_4P-L12.0-W12.0-P5.00-LS12.5-EH]  16.38 62.87 0 top
SW16  B3F-4005  [SW-TH_4P-L12.0-W12.0-P5.00-LS12.5-EH]  86.11 62.49 0 top
SW19  TC-1102-B-A-B  [SW-TH_4P-L6.0-W6.0-P4.50-LS6.5]  23.5 73.29 0 top
SW20  TC-1102-B-A-B  [SW-TH_4P-L6.0-W6.0-P4.50-LS6.5]  79.12 73.03 0 top
U1  CH340G  [SOIC-16_L9.9-W3.9-P1.27-LS6.0-BL]  8.76 50.43 90 top
U13  STC15F2K60S2-28I-PDIP40  [DIP-40_L52.3-W13.9-P2.54-LS15.2-BL]  51.82 53.73 0 top
USB1  USB-B01  [USB-B-TH_USB-B01]  49.28 72.14 0 top
X1  12MHz  [HC-49US_L11.5-W4.5-P4.88]  9.22 41.16 0 top

## Footprints (pads in the part's own frame, mm; a bottom-side part is the same pattern mirrored in y, then rotated)
CAP-TH_BD6.3-P2.50-D1.0-FD
  round 1.6 hole 1: 1(-1.27,0) 2(1.27,0)
CAP-TH_L5.0-W2.5-P2.54-D0.7
  round 1.194 hole 0.711: 1(-1.27,0) 2(1.27,0)
CAP-TH_L5.0-W2.5-P5.08-D0.7
  round 1.4 hole 0.8: 1(-2.54,0) 2(2.54,0)
DIP-40_L52.3-W13.9-P2.54-LS15.2-BL
  rect 1.8x1.8 hole 1: 1(-24.13,-7.62)
  round 1.8 hole 1: 2(-21.59,-7.62) 3(-19.05,-7.62) 4(-16.51,-7.62) 5(-13.97,-7.62) 6(-11.43,-7.62) 7(-8.89,-7.62) 8(-6.35,-7.62) 9(-3.81,-7.62) 10(-1.27,-7.62) 11(1.27,-7.62) 12(3.81,-7.62) 13(6.35,-7.62) 14(8.89,-7.62) 15(11.43,-7.62) 16(13.97,-7.62) 17(16.51,-7.62) 18(19.05,-7.62) 19(21.59,-7.62) 20(24.13,-7.62) 21(24.13,7.62) 22(21.59,7.62) 23(19.05,7.62) 24(16.51,7.62) 25(13.97,7.62) 26(11.43,7.62) 27(8.89,7.62) 28(6.35,7.62) 29(3.81,7.62) 30(1.27,7.62) 31(-1.27,7.62) 32(-3.81,7.62) 33(-6.35,7.62) 34(-8.89,7.62) 35(-11.43,7.62) 36(-13.97,7.62) 37(-16.51,7.62) 38(-19.05,7.62) 39(-21.59,7.62) 40(-24.13,7.62)
DO-35_BD2.0-L4.0-P8.00-D0.5-FD
  round 1.8 hole 1: 1(-4,0) 2(4,0)
HC-49US_L11.5-W4.5-P4.88
  rect 1.5x1.5 hole 0.9: 1(-2.44,0)
  round 1.5 hole 0.9: 2(2.44,0)
HDR-TH_4P-P2.54-V-M
  rect 1.7x1.7 hole 1.1: 1(-3.81,0)
  round 1.7 hole 1.1: 2(-1.27,0) 3(1.27,0) 4(3.81,0)
hdr-th_20p-p2.54-v-m-4
  rect 1.6x1.6 hole 1.05: 1(-24.13,0)
  round 1.6 hole 1.05: 2(-21.59,0) 3(-19.05,0) 4(-16.51,0) 5(-13.97,0) 6(-11.43,0) 7(-8.89,0) 8(-6.35,0) 9(-3.81,0) 10(-1.27,0) 11(1.27,0) 12(3.81,0) 13(6.35,0) 14(8.89,0) 15(11.43,0) 16(13.97,0) 17(16.51,0) 18(19.05,0) 19(21.59,0) 20(24.13,0)
LED-TH_BD4.0-P2.50-RD
  round 1.651 hole 0.9: 1(-1.25,0) 2(1.25,0)
RES-TH_BD1.7-L3.5-P7.50-D0.5
  round 1.879 hole 0.9: 1(-3.75,0)
  round 1.879 hole 0.899: 2(3.75,0)
RES-TH_BD2.3-L3.7-P7.70-D0.9
  round 1.3 hole 0.7: 1(-3.81,0) 2(3.81,0)
SOIC-16_L9.9-W3.9-P1.27-LS6.0-BL
  oval 0.602x1.971 smd: 1(-4.445,-2.736) 2(-3.175,-2.736) 3(-1.905,-2.736) 4(-0.635,-2.736) 5(0.635,-2.736) 6(1.905,-2.736) 7(3.175,-2.736) 8(4.445,-2.736) 9(4.445,2.736) 10(3.175,2.736) 11(1.905,2.736) 12(0.635,2.736) 13(-0.635,2.736) 14(-1.905,2.736) 15(-3.175,2.736) 16(-4.445,2.736)
SW-TH_4P-L6.0-W6.0-P4.50-LS6.5
  round 1.8 hole 1.2: 1(-3.25,2.25) 2(3.25,2.25) 3(-3.25,-2.25) 4(3.25,-2.25)
SW-TH_4P-L12.0-W12.0-P5.00-LS12.5-EH
  round 2.5 hole 1.5: 1(6.25,-2.54) 2(-6.25,-2.54) 3(6.25,2.54) 4(-6.25,2.54)
SW-TH_6P-L8.0-W8.0-P2.50
  rect 1.524x1.524 hole 1: 1(-2.5,-3)
  round 1.524 hole 1: 2(0,-3) 3(2.5,-3) 4(-2.5,3) 5(0,3) 6(2.5,3)
USB-B-TH_USB-B01
  round 1.524 hole 1: 1(-1.25,-2.355) 2(1.25,-2.355) 3(1.25,-0.355) 4(-1.25,-0.355)
  round 3.3 hole 2.5: 5(-6,2.355) 6(6,2.355)

## Nets
As in the schematic, except:
P10: CN2.12 U13.9
P11: CN2.11 U13.10

Pads without a net: SW9 1 4 5 6; SW10 1 4; SW11 2 3; SW12 2 3; SW13 2 3; SW14 2 3; SW15 2 3; SW16 2 3; SW19 2 3; SW20 2 3; U1 9 10 11 12 13 14 15

## Via types
v1: diameter 0.61, hole 0.305, Top Layer to Bottom Layer, 32 vias

## Routing (per net, layer and track width the routed paths; a pad name or vN(x,y) marks a point on that pad's centre or on a via; arc(x,y) is an arc through that point)
GND: length 4
  Top Layer w0.254: U13.20 76.2,45.85 CN2.1
  vias: v1(2.16,17.15) v1(3.43,22.36) v1(4.19,11.06) v1(5.84,20.33) v1(9.02,18.04) v1(11.42,10.02) v1(12.7,20.07) v1(14.1,77.48) v1(20.95,80.65) v1(28.07,7.88) v1(28.32,80.52) v1(64.52,79) v1(69.47,76.71) v1(70.48,80.78) v1(73.15,6.86) v1(75.57,8.9) v1(78.36,79.64) v1(78.74,4.96) v1(81.41,7.25) v1(84.2,26.04) v1(85.6,4.83) v1(87.63,28.58) v1(89.28,71.38) v1(89.28,7.5) v1(90.8,27.31) v1(93.22,29.09) v1(94.74,24.77) v1(94.87,10.42) v1(96.14,31.12)
VCC: length 46.1
  Top Layer w0.254: U13.18 70.87,42.42 CN2.3
  Top Layer w0.762: C9.2 71.5,42.17 CN2.3 ; C9.2 78.56,35.11 SW10.2 ; C9.2 78.93,39.7 R10.2 84.63,40.75 85.36,40.75 ; 85.36,40.75 81.92,44.2 81.92,51.75 C2.2 ; 85.36,40.75 SW9.3
VDD: length 158.5
  Top Layer w0.762: U1.16 2.79,42.75 2.79,39.76 6.38,36.17 22.07,36.17 24.54,38.65 24.54,41.12 22.48,43.19 20.7,43.19 19.56,44.33 19.56,48.65 20.7,49.79 C10.2 22.73,51.95 24.38,51.95 25.4,52.97 25.4,66.17 33.15,73.92 38.23,73.92 39.24,72.9 C3.1 40.45,69.79 USB1.1 49.99,67.82 81.41,67.82 88.65,60.59 88.65,54.69 C1.1 88.52,50.99 88.52,44.97 SW9.2
D+: length 60.1
  Top Layer w0.254: v1(9.53,51.7) 10.86,51.7 U1.5
  Bottom Layer w0.254: USB1.3 50.53,72.29 49.4,73.41 47.5,73.41 45.85,71.76 41.4,71.76 40.39,72.78 34.29,72.78 30.73,69.22 27.94,69.22 24.51,65.79 24.51,59.22 21.75,56.46 10.58,56.46 9.56,55.45 9.56,51.73 v1(9.53,51.7)
D-: length 53.4
  Top Layer w0.254: v1(24.13,57.03) 22.48,55.38 22.48,53.35 20.45,51.31 13.34,51.31 12.32,52.33 U1.6
  Bottom Layer w0.254: USB1.2 50.53,69.15 49.83,68.46 28.07,68.46 25.27,65.67 25.27,57.54 24.77,57.03 v1(24.13,57.03)
P00: length 4
  Top Layer w0.254: CN2.20 27.69,42.42 U13.1
P01: length 4
  Top Layer w0.254: U13.2 30.48,45.85 CN2.19
P02: length 4
  Top Layer w0.254: CN2.18 32.89,42.3 32.89,45.98 U13.3
P03: length 4
  Top Layer w0.254: CN2.17 35.31,42.42 U13.4
P04: length 4
  Top Layer w0.254: CN2.16 38.1,45.85 U13.5
P05: length 4
  Top Layer w0.254: U13.6 40.39,42.42 CN2.15
P06: length 4
  Top Layer w0.254: CN2.14 42.93,42.42 U13.7
P07: length 4
  Top Layer w0.254: CN2.13 45.47,42.42 U13.8
P10: length 4
  Top Layer w0.254: U13.9 48.01,42.42 CN2.12
P11: length 4
  Top Layer w0.254: CN2.11 50.8,45.85 U13.10
P12: length 4
  Top Layer w0.254: U13.11 53.09,42.42 CN2.10
P13: length 4
  Top Layer w0.254: U13.12 55.63,42.42 CN2.9
P14: length 4
  Top Layer w0.254: U13.13 58.17,42.42 CN2.8
P15: length 4
  Top Layer w0.254: CN2.7 60.71,42.42 U13.14
P16: length 4
  Top Layer w0.254: U13.15 63.25,42.42 CN2.6
P17: length 4
  Top Layer w0.254: CN2.5 65.79,42.42 U13.16
P20: length 4.3
  Top Layer w0.254: CN1.9 U13.32
P21: length 4.3
  Top Layer w0.254: CN1.8 U13.33
P22: length 4.3
  Top Layer w0.254: CN1.7 U13.34
P23: length 4.3
  Top Layer w0.254: CN1.6 U13.35
P24: length 4.3
  Top Layer w0.254: CN1.5 U13.36
P25: length 4.3
  Top Layer w0.254: CN1.4 U13.37
P26: length 4.3
  Top Layer w0.254: CN1.3 U13.38
P27: length 4.3
  Top Layer w0.254: CN1.2 U13.39
P32: length 4.3
  Top Layer w0.254: CN1.18 U13.23
P33: length 4.3
  Top Layer w0.254: CN1.17 U13.24
P34: length 4.3
  Top Layer w0.254: CN1.16 U13.25
P35: length 4.3
  Top Layer w0.254: CN1.15 U13.26
P36: length 5.4
  Top Layer w0.254: CN1.14 60.71,60.84 61.09,60.46
P37: length 4.3
  Top Layer w0.254: CN1.13 U13.28
P41: length 4.3
  Top Layer w0.254: CN1.12 U13.29
P42: length 4.3
  Top Layer w0.254: CN1.11 U13.30
P44: length 4.3
  Top Layer w0.254: CN1.10 U13.31
P45: length 4.3
  Top Layer w0.254: CN1.1 U13.40
P54: length 17.6
  Top Layer w0.254: R12.2 65.41,34.68 R11.1 71.37,37.09 C9.1 71.37,39.38 CN2.4 68.58,45.85 U13.17
P55: length 4
  Top Layer w0.254: U13.19 73.41,42.42 CN2.2
RXD: length 65.9
  Top Layer w0.254: D1.1 22.65,45.87 24.15,45.87 35.18,56.9 71.5,56.9 U13.21 CN1.20
RXDCH340: length 6.6
  Top Layer w0.254: R1.2 16.2,48.52 U1.3
TXD: length 74.5
  Top Layer w0.254: 73.41,66.17 U13.22
  Bottom Layer w0.254: U13.22 73.41,53.09 71.12,50.81 28.9,50.81 17.78,39.69 R1.1
TXDCH340: length 18
  Top Layer w0.254: D1.2 19.49,37.34 16.76,37.34 14.61,39.5 14.61,45.09 12.45,47.25 U1.2
$1N13235: length 7.9
  Top Layer w0.254: R10.1 88.38,32.08 LED3.2
$1N13359: length 3.1
  Top Layer w0.254: R11.2 69.05,26.97 SW10.3
$1N17550: length 26.4
  Top Layer w0.254: C4.2 19.94,53.73 18.29,52.08 13.72,52.08 12.19,53.6 U1.7 11.19,53.91 10.27,53.91 8.51,52.15 8.51,42.9 X1.1
$1N17568: length 3.6
  Top Layer w0.254: C11.2 14.73,49.79 U1.4
$1N17576: length 34.8
  Top Layer w0.254: X1.2 8.85,38.36 6.48,38.36 4.45,40.39 4.45,41.41 7.87,44.84 7.87,53.47 9.53,55.12 11.24,55.12 U1.8 16.76,54.87 C5.2
$1N18234: length 14.4
  Top Layer w0.254: SW11.1 24.54,31.76 29.85,31.76 30.61,30.99 H1.1
$1N18255: length 26.9
  Top Layer w0.254: 20.47,7.5 24.38,7.5 32.26,15.37 32.26,24.9 30.61,26.55
$1N18272: length 62.9
  Bottom Layer w0.254: SW13.1 79.66,14.79 79.48,14.61 76.03,14.61 54.82,35.82 42.42,35.82 H1.3
$1N18278: length 81.8
  Bottom Layer w0.254: H1.4 30.86,21.47 42.93,33.53 55.98,33.53 78.21,11.31 93.73,11.31 95.91,13.5 95.91,14.48 SW14.1
$1N18641: length 75.1
  Top Layer w0.254: H2.1 21.08,21.22 v1(19.69,22.61)
  Bottom Layer w0.254: v1(19.69,22.61) 19.43,22.36 7.75,22.36 2.92,27.18 2.92,55.38 5.08,57.54 11.81,57.54 14.61,60.33 SW15.1
$1N18645: length 109.4
  Bottom Layer w0.254: SW16.1 95.38,56.93 95.38,34.04 91.44,30.11 61.98,30.11 55.25,36.84 41.91,36.84 36.52,31.45 28.9,31.45 27.69,30.23 27.69,26.04 H2.2
$1N18647: length 89.6
  Bottom Layer w0.254: 25.65,26.3 H2.3 ; 25.65,26.3 26.02,26.3 ; 25.65,26.3 20.57,21.22 7.37,21.22 2.03,26.55 2.03,57.16 5.84,60.97 5.84,68.71 12.79,75.66 20.12,75.66 SW19.1
$1N18651: length 96
  Bottom Layer w0.254: H2.4 24.77,29.47 24.26,29.47 23.24,30.49 23.24,44.08 28.07,48.9 70.74,48.9 77.72,55.89 77.72,73.43 SW20.1
$1N21741: length 7.6
  Top Layer w0.254: H3.4 H3.3 H3.2 H3.1
$1N21762: length 7.6
  Top Layer w0.254: H4.4 H4.3 H4.2 H4.1

## Copper pours and planes (outline as drawn; the poured copper is in the pictures)
GND on Top Layer: -6.6,90.94 101.6,90.94 101.6,-1.39 -6.6,-1.39
GND on Bottom Layer: -8,91.95 100.2,91.95 100.2,-0.37 -8,-0.37
